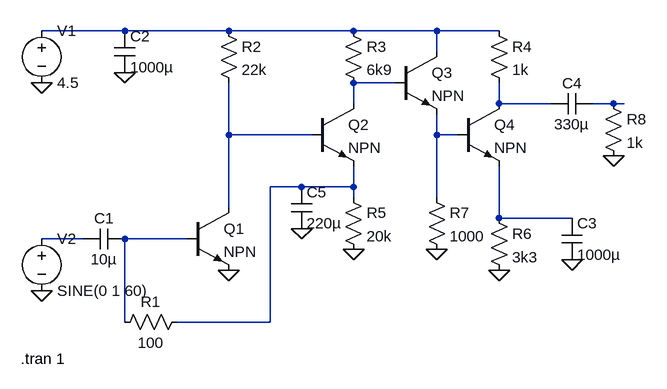
[diagram p0: schematic NNclassicFuzz.asc]
NNclassicFuzz.asc, the LTspice schematic file:
Version 4
SHEET 1 1192 680
WIRE 160 -160 32 -160
WIRE 320 -160 160 -160
WIRE 512 -160 320 -160
WIRE 640 -160 512 -160
WIRE 736 -160 640 -160
WIRE 640 -128 640 -160
WIRE 576 -80 512 -80
WIRE 512 -48 512 -80
WIRE 736 -48 736 -80
WIRE 816 -48 736 -48
WIRE 912 -48 880 -48
WIRE 928 -48 912 -48
WIRE 320 0 320 -80
WIRE 448 0 320 0
WIRE 640 0 640 -32
WIRE 672 0 640 0
WIRE 432 80 384 80
WIRE 512 80 512 48
WIRE 512 80 432 80
WIRE 512 96 512 80
WIRE 640 96 640 0
WIRE 320 112 320 0
WIRE 736 128 736 48
WIRE 848 128 736 128
WIRE 96 160 32 160
WIRE 256 160 160 160
WIRE 160 288 160 160
WIRE 384 288 384 80
WIRE 384 288 240 288
FLAG 160 -96 0
FLAG 320 208 0
FLAG 512 176 0
FLAG 640 176 0
FLAG 736 208 0
FLAG 848 192 0
FLAG 32 -80 0
FLAG 32 240 0
FLAG 432 144 0
FLAG 912 32 0
SYMBOL cap 160 144 R90
WINDOW 0 0 32 VBottom 2
WINDOW 3 32 32 VTop 2
SYMATTR InstName C1
SYMATTR Value 10µ
SYMBOL res 256 272 R90
WINDOW 0 0 56 VBottom 2
WINDOW 3 32 56 VTop 2
SYMATTR InstName R1
SYMATTR Value 100
SYMBOL npn 256 112 R0
SYMATTR InstName Q1
SYMBOL npn 448 -48 R0
SYMATTR InstName Q2
SYMBOL npn 576 -128 R0
SYMATTR InstName Q3
SYMBOL npn 672 -48 R0
SYMATTR InstName Q4
SYMBOL cap 144 -160 R0
SYMATTR InstName C2
SYMATTR Value 1000µ
SYMBOL res 304 -176 R0
SYMATTR InstName R2
SYMATTR Value 22k
SYMBOL res 496 -176 R0
SYMATTR InstName R3
SYMATTR Value 6k9
SYMBOL res 720 -176 R0
SYMATTR InstName R4
SYMATTR Value 1k
SYMBOL res 496 80 R0
SYMATTR InstName R5
SYMATTR Value 20k
SYMBOL res 720 112 R0
SYMATTR InstName R6
SYMATTR Value 3k3
SYMBOL res 624 80 R0
SYMATTR InstName R7
SYMATTR Value 1000
SYMBOL cap 832 128 R0
SYMATTR InstName C3
SYMATTR Value 1000µ
SYMBOL cap 880 -64 R90
WINDOW 0 0 32 VBottom 2
WINDOW 3 32 32 VTop 2
SYMATTR InstName C4
SYMATTR Value 330µ
SYMBOL voltage 32 -176 R0
WINDOW 123 0 0 Left 0
WINDOW 39 0 0 Left 0
SYMATTR InstName V1
SYMATTR Value 4.5
SYMBOL voltage 32 144 R0
WINDOW 123 0 0 Left 0
WINDOW 39 0 0 Left 0
SYMATTR InstName V2
SYMATTR Value SINE(0 1 60)
SYMBOL cap 416 80 R0
SYMATTR InstName C5
SYMATTR Value 220µ
SYMBOL res 896 -64 R0
SYMATTR InstName R8
SYMATTR Value 1k
TEXT 0 344 Left 2 !.tran 1

The netlist it stands for:
* NNclassicFuzz.asc
C1 N010 N009 10µ
R1 N007 N010 100
Q1 N005 N010 0 0 NPN
Q2 N002 N005 N007 0 NPN
Q3 N001 N002 N006 0 NPN
Q4 N003 N006 N008 0 NPN
C2 N001 0 1000µ
R2 N001 N005 22k
R3 N001 N002 6k9
R4 N001 N003 1k
R5 N007 0 20k
R6 N008 0 3k3
R7 N006 0 1000
C3 N008 0 1000µ
C4 N004 N003 330µ
V1 N001 0 4.5
V2 N009 0 SINE(0 1 60)
C5 N007 0 220µ
R8 N004 0 1k
.model NPN NPN
.model PNP PNP
.lib standard.bjt
.tran 1
.backanno
.end